# Altium schematic sheet Nixie_Controller.SchDoc
size A4
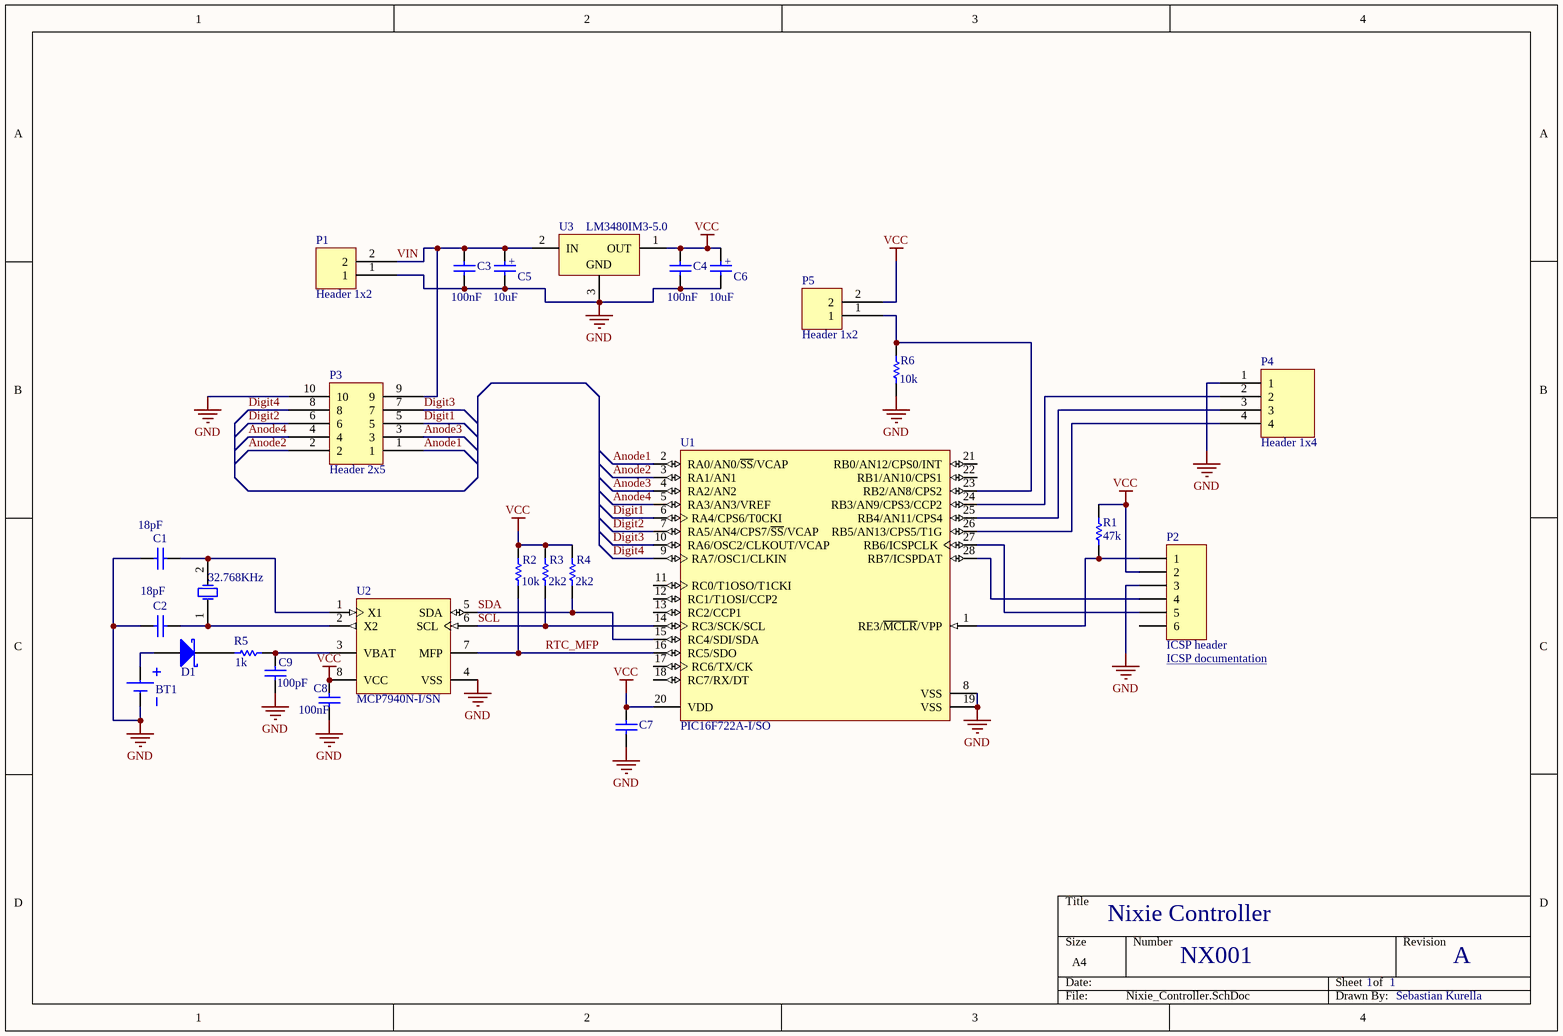
[diagram p0: Nixie_Controller.SchDoc]

## Parts
?  32.768KHz  [ABRA-ABS07-2_V]
BT1  120591-1  [TECO-120591-1-2_V]  (value not drawn)
C1  value 18pF  [CAPC0805(2012)100_M]  (hidden comment: CAP 18pF 16V 0805(2012))
C2  value 18pF  [CAPC0805(2012)100_M]  (hidden comment: CAP 18pF 16V 0805(2012))
C3  value 100nF  [CAPC0805(2012)100_L]  (hidden comment: CAP 100nF 16V 0805(2012))
C4  value 100nF  [CAPC0805(2012)100_L]  (hidden comment: CAP 100nF 16V 0805(2012))
C5  value 10uF  [Radial Cap 6.3mm]  (hidden comment: Polarized capacitor)
C6  value 10uF  [Radial Cap 6.3mm]  (hidden comment: Polarized capacitor)
C7  CAP 100nF 10V 0805(2012)  [CAPC0805(2012)100_M]  (value not drawn)
C8  value 100nF  [CAPC0805(2012)100_M]  (hidden comment: CAP 100nF 10V 0805(2012))
C9  value 100pF  [CAPC0805(2012)100_L]  (hidden comment: CAP 100pF 10V 0805(2012))
D1  SS14-E3/5AT  [VISH-DO-214AC-2_V]  (value not drawn)
P1  Header 1x2  [Header 1x2]
P2  ICSP header  [HDR1X6H]
P3  Header 2x5  [Header 2x5]
P4  Header 1x4  [HEADER 1X4]
P5  Header 1x2  [Header 1x2]
R1  value 47k  [RESC0805(2012)_L]  (hidden comment: 47K 5% 0805(2012))
R2  value 10k  [RESC0805(2012)_L]  (hidden comment: 10K 5% 0805(2012))
R3  value 2k2  [RESC0805(2012)_L]  (hidden comment: 2K2 5% 0805(2012))
R4  value 2k2  [RESC0805(2012)_L]  (hidden comment: 2K2 5% 0805(2012))
R5  value 1k  [RESC0805(2012)_N]  (hidden comment: 1K 5% 0805(2012))
R6  value 10k  [RESC0805(2012)_L]  (hidden comment: 10K 5% 0805(2012))
U1  PIC16F722A-I/SO  [MCHP-SOIC-SO28_L]
U2  MCP7940N-I/SN  [SOIC-SN8_M]
U3  LM3480IM3-5.0  [MF03A_N]

## Nets
GND: BT1.2(-) C1.1 C2.1 C3.1 C4.1 C5.2 C6.2 C7.1 C8.1 C9.1 P1.1 P2.3 P3.10 P4.1 R6.1 U1.8(VSS) U1.19(VSS) U2.4(VSS) U3.3(GND)
VCC: C4.2 C6.1 C7.2 C8.2 P2.2 P5.2 R1.2 R2.2 R3.2 R4.2 U1.20(VDD) U2.8(VCC) U3.1(OUT)
Anode1: P3.1 U1.2(RA0/AN0/~{SS}/VCAP)
Anode2: P3.2 U1.3(RA1/AN1)
Anode3: P3.3 U1.4(RA2/AN2)
Anode4: P3.4 U1.5(RA3/AN3/VREF)
Digit1: P3.5 U1.6(RA4/CPS6/T0CKI)
Digit2: P3.6 U1.7(RA5/AN4/CPS7/~{SS}/VCAP)
Digit3: P3.7 U1.10(RA6/OSC2/CLKOUT/VCAP)
Digit4: P3.8 U1.9(RA7/OSC1/CLKIN)
RTC_MFP: R2.1 U1.16(RC5/SDO) U2.7(MFP)
SCL: R3.1 U1.14(RC3/SCK/SCL) U2.6(SCL)
SDA: R4.1 U1.15(RC4/SDI/SDA) U2.5(SDA)
VIN: C3.2 C5.1 P1.2 P3.9 U3.2(IN)
Net?_1: ?.1(X1) C2.2 U2.2(X2)
Net?_2: ?.2(X2) C1.2 U2.1(X1)
NetBT1_1: BT1.1(+) D1.1(A)
NetC9_2: C9.2 R5.2 U2.3(VBAT)
NetD1_2: D1.2(K) R5.1
NetP2_1: P2.1 R1.1 U1.1(RE3/~{MCLR}/VPP)
NetP2_4: P2.4 U1.28(RB7/ICSPDAT)
NetP2_5: P2.5 U1.27(RB6/ICSPCLK)
NetP4_2: P4.2 U1.24(RB3/AN9/CPS3/CCP2)
NetP4_3: P4.3 U1.25(RB4/AN11/CPS4)
NetP4_4: P4.4 U1.26(RB5/AN13/CPS5/T1G)
NetP5_1: P5.1 R6.2 U1.23(RB2/AN8/CPS2)

Not connected (* = marked no-connect by the designer): P2 6; U1 11(RC0/T1OSO/T1CKI) 12(RC1/T1OSI/CCP2) 13(RC2/CCP1) 17(RC6/TX/CK) 18(RC7/RX/DT) 21(RB0/AN12/CPS0/INT) 22(RB1/AN10/CPS1)

## Notes on the sheet
- (near P2) ICSP documentation <http://ww1.microchip.com/downloads/en/DeviceDoc/PICkit_3_User_Guide_51795A.pdf#page=15>
- Nixie Controller
- NX001
- 1
- A
- Sebastian Kurella
- (in symbol CAP) +

## Library data of the parts
? = CMP-0447-00001-1: Crystal, 32.768 kHz, 12.5 pF, -40 to 85 degC, SMD Low Profile 3.2 x 1.5 x 0.9 mm, Tape and Reel; PartNumber: ABS07-32.768KHz-T; Manufacturer: Abracon; Drive Level (Type): 0.1 uW; Operation Mode: Flexural Mode (Tuning Fork); Shunt Capacitance (C0): 0.9 to 1.2 pF; Equivalent Series Resistance (R1): 70 Kohm; Insulation Resistance (Min): 500 Mohm; Q Value (Type): 30000; Frequency Tolerance @+25degC: +/- 20 ppm; Load Capacitance (CL): 12.5 pF; Operating Temperature: -40 to 85 degC; ComponentLink3Description: Package Specification; DatasheetVersion: 04.03.13; Mounting Technology: Surface Mount; Frequency: 32.768 kHz; ComponentLink1URL: http://www.abracon.com/; Packing: Tape and Reel; ComponentLink3URL: http://www.abracon.com/Resonators/ABS07.pdf; ComponentLink2Description: Datasheet; PackageDescription: 2-Pin Hand Drawn, Body 3.2x1.5mm, Pitch 2.5mm; ComponentLink1Description: Manufacturer URL; PackageReference: ABS07-2; ComponentLink2URL: http://www.abracon.com/Resonators/ABS07.pdf
BT1 = CMP-0438-00001-1: Lithium Battery Holder for CR2032 3V Cell; Manufacturer: TE Connectivity; Body Shape: Horizontal Cylindrical; Packing Type: Tray; ComponentLink2Description: Datasheet; ComponentLink2URL: http://www.te.com/commerce/DocumentDelivery/DDEController?Action=showdoc&DocId=Customer+Drawing%7F120591%7FH%7Fpdf%7FEnglish%7FENG_CD_120591_H.pdf%7F120591-1; DatasheetVersion: Rev. H, 01/2013; PackageReference: 120591-1; ComponentLink1Description: Manufacturer URL; Mounting Technology: Through Hole; PackageDescription: Lithium Battery Holder; ComponentLink1URL: http://www.te.com/; PartNumber: 120591-1
C1 C2 = CMP-1036-01121-1: CAP 18pF 16V ±5% 0805 (2012 Metric) Thickness 1mm SMD; Case-Metric: 2012; Case-EIA: 0805; Tolerance: ±5%; Rated Voltage: 16 V; Max Thickness: 1 mm; Technology: SMT
C3 C4 = CMP-1036-04405-1: CAP 100nF 16V ±20% 0805 (2012 Metric) Thickness 1mm SMD; Case-EIA: 0805; Case-Metric: 2012; Tolerance: ±20%; Max Thickness: 1 mm; Rated Voltage: 16 V; Technology: SMT
C5 C6 = CAP
C7 C8 = CMP-1036-04393-1: CAP 100nF 10V ±5% 0805 (2012 Metric) Thickness 1mm SMD; Case-EIA: 0805; Case-Metric: 2012; Rated Voltage: 10 V; Tolerance: ±5%; Technology: SMT; Max Thickness: 1 mm
  C7: Value: 100nF
C9 = CMP-1036-01930-1: CAP 100pF 10V ±2% 0805 (2012 Metric) Thickness 1mm SMD; Case-EIA: 0805; Case-Metric: 2012; Technology: SMT; Max Thickness: 1 mm; Rated Voltage: 10 V; Tolerance: ±2%
D1 = CMP-0549-00004-1: Schottky Barrier Rectifier, 40 V Maximum DC Blocking Voltage, -65 to 125 degC, 2-Pin SMA Case, RoHS; Manufacturer: Vishay Semiconductor; IFSM: 40 A; IF(AV): 1 A Max.; VRRM: 40 V Max.; VRMS: 28 V Max.; PackageReference: DO-214AC-2; RoHS: TRUE; DatasheetVersion: 12/17/2012; ComponentLink1Description: Manufacturer URL; ComponentLink2URL: http://www.vishay.com/docs/88746/ss12.pdf; PartNumber: SS14-E3/5AT; PackageVersion: Dec-12; Operating Temperature: -65 to 125 degC; ComponentLink3URL: http://www.vishay.com/docs/88746/ss12.pdf; PackageDescription: 2-Pin SMD, Body 4.245 x 2.665 mm, Height 2.29 mm; ComponentLink1URL: http://www.vishay.com/; ComponentLink3Description: Package Specification; ComponentLink2Description: Datasheet; Mounting Technology: Surface Mount; VDC: 40 V Max.
P1 P5 = Header 1x2: TE 640456-2
P2 = Header 6H: Header, 6-Pin, Right Angle; LatestRevisionDate: 17-Jul-2002; LatestRevisionNote: Re-released for DXP Platform.; Publisher: Altium Limited
P3 = Header IDC10: TE 5103310-1
P4 = Header 1x4: TE 640456-4
R1 = CMP-1013-00114-1: 47K 0.125W 5% 0805 (2012 Metric)  SMD; Case-Metric: 2012; Case-EIA: 0805; Tolerance: 5 %; Power: 0.125 W; Technology: SMT
R2 R6 = CMP-1013-00098-1: 10K 0.125W 5% 0805 (2012 Metric)  SMD; Case-EIA: 0805; Case-Metric: 2012; Power: 0.125 W; Technology: SMT; Tolerance: 5 %
R3 R4 = CMP-1013-00082-1: 2K2 0.125W 5% 0805 (2012 Metric)  SMD; Case-EIA: 0805; Case-Metric: 2012; Power: 0.125 W; Tolerance: 5 %; Technology: SMT
R5 = CMP-1013-00074-1: 1K 0.125W 5% 0805 (2012 Metric)  SMD; Case-EIA: 0805; Case-Metric: 2012; Technology: SMT; Power: 0.125 W; Tolerance: 5 %
U1 = CMP-0115-02602-1: Flash Microcontroller with nanoWatt XLP Technology, 20 MHz, 24 I/O, -40 to 85 degC, 28-pin SOIC (SO28), Tube; Manufacturer: Microchip; I/O Pins: 24; # of A/D Channels: 11; Digital Communication: 1 -A/E/USART, 1 -SSP(SPI/I2C); RAM: 128; Max. CPU Speed MHz: 20; Program Memory KWords: 2; Program Memory KBytes: 3.5; Internal Oscillator: 16 MHz, 500 kHz; Operation Voltage Range: 1.8V - 5.5V; Timers: 2 - 8-bit, 1 - 16-bit, 0 - 32-bit; ComponentLink2Description: Package Specification; ComponentLink2URL: http://www.microchip.com/stellent/groups/techpub_sg/documents/packagingspec/en012702.pdf; PartNumber: PIC16F722A-I/SO; ComponentLink3Description: URL Link1; Memory Type: Flash; PackageReference: SOIC-SO28; PackageVersion: C04-052C, 12/2012; ComponentLink3URL: Product URL:http://www.microchip.com/datasheet/PIC16F722A; ComponentLink1Description: Datasheet; ComponentLink1URL: http://ww1.microchip.com/downloads/en/DeviceDoc/41417B.pdf; Packing: TUBE; Mounting Technology: Surface Mount; RoHS: TRUE; DatasheetVersion: Rev. B; PackageDescription: 28-Lead Plastic Small Outline, 17.9 x 7.5 mm Body, 1.27 mm Pitch
U2 = CMP-0186-00196-1: Low-Cost I2C Real-Time Clock/Calendar with SRAM and Battery Switchover, 8-Pin SOIC, Industrial Temperature; PackageDescription: 8-Lead Plastic Small Outline (SN) - Narrow, 3.90mm Body [SOIC]; Code_JEDEC: MS-012; ComponentLink2Description: Datasheet; DatasheetVersion: revC, Dec-2011; ComponentLink3Description: Package Specification; ComponentLink2URL: http://ww1.microchip.com/downloads/en/DeviceDoc/25010C.pdf; PackageVersion: revBB, Aug-2009; ComponentLink3URL: http://www.microchip.com/stellent/groups/techpub_sg/documents/packagingspec/en012702.pdf; ComponentLink1URL: http://www.microchip.com/; ComponentLink1Description: Manufacturer URL; Code_IPC: SOIC127P600-8; PackageReference: SOIC-SN8; Supplier 1: Farnell; Supplier Part Number 1: 2361122
U3 = CMP-0062-02200-1: 100 mA, Quasi Low-Dropout Linear Voltage Regulator, 3-pin SOT-23, Pb-Free; Manufacturer: National Semiconductor; PackageTopMarking: L0B*XTT; PowerWise: N; CompType: LDO IC; PackageDescription: Molded SOT-23, .115 x .051 x .037in Body, 3 Lead, .075 in Pitch; PackageReference: MF03A; PinCount: 3; PackageVersion: revB, Mar-2003; RoHS: Y; DatasheetVersion: Mar-2005